# Altium schematic sheet Power_Architecture.SchDoc: PCB_Personal_Gif
size A4; DrawnBy: Ravi dusi; SheetNumber: 4; SheetTotal: 4
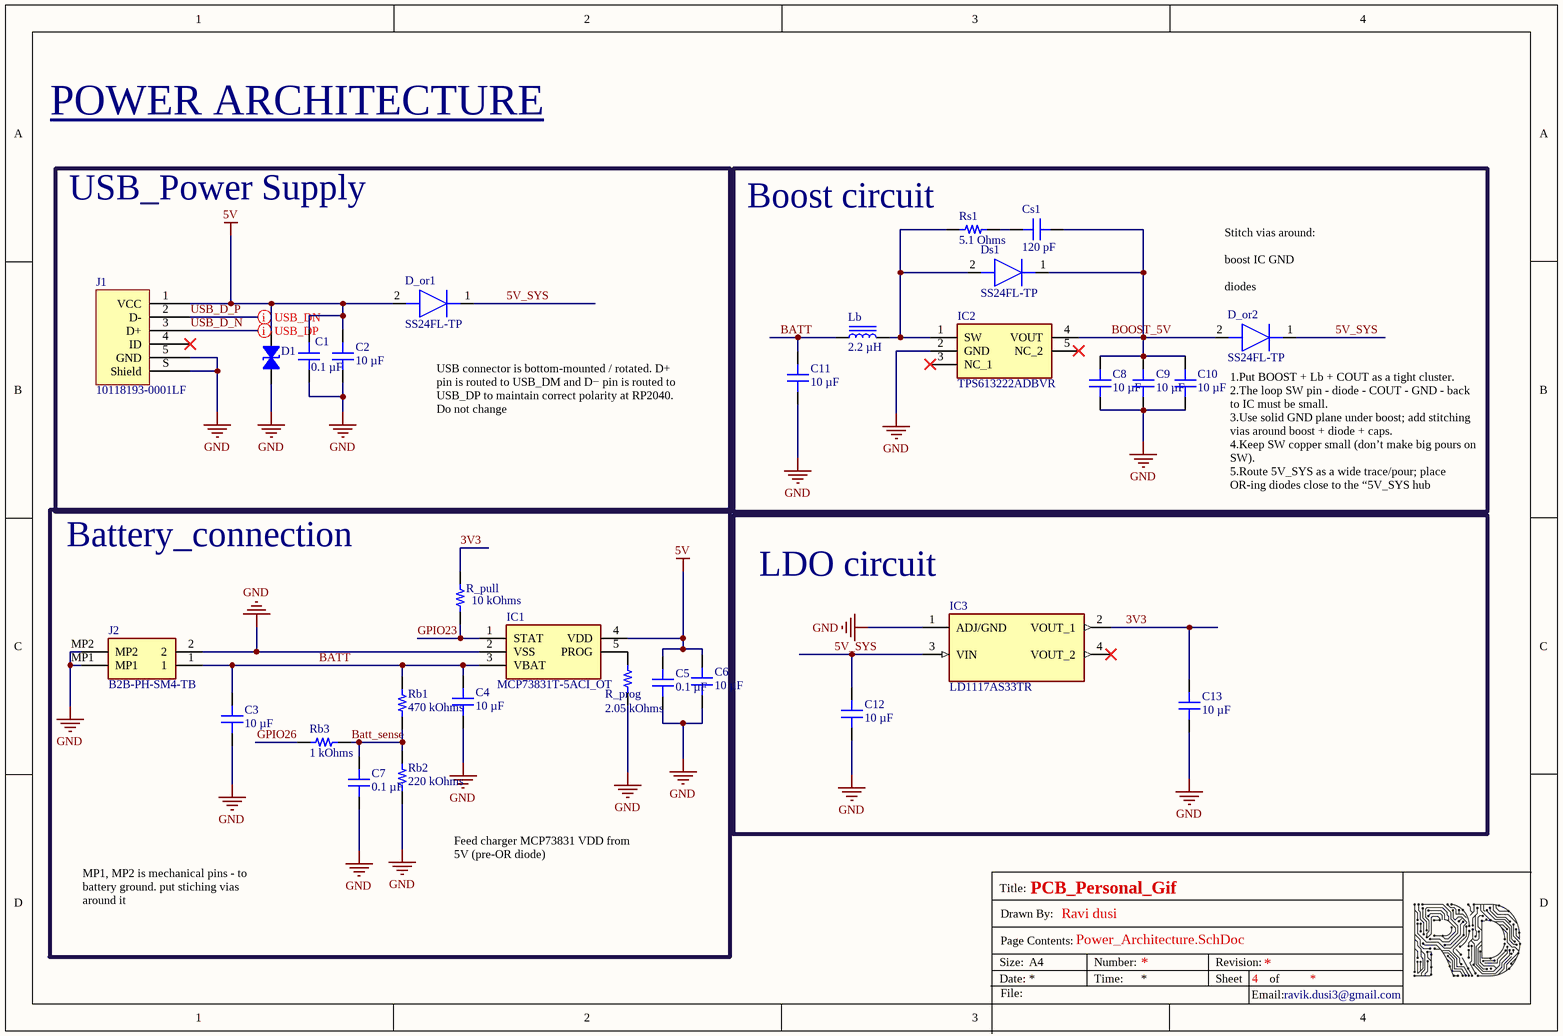
[diagram p0: Power_Architecture.SchDoc]

## Parts
C1  0.1 µF  [CAP 0402_1005]
C2  10 µF  [CAP 0402_1005]
C3  10 µF  [CAP 0402_1005]
C4  10 µF  [CAP 0402_1005]
C5  0.1 µF  [CAP 0402_1005]
C6  10 µF  [CAP 0402_1005]
C7  0.1 µF  [CAP 0402_1005]
C8  10 µF  [CAP 0402_1005]
C9  10 µF  [CAP 0402_1005]
C10  10 µF  [CAP 0402_1005]
C11  10 µF  [CAP 0402_1005]
C12  10 µF  [CAP 0402_1005]
C13  10 µF  [CAP 0402_1005]
Cs1  120 pF  [CAP 0402_1005]
D1  PGSMAJ12CA E3G  [DO214AC SMA]  (value not drawn)
D_or1  SS24FL-TP  [SODFL5026X125N]
D_or2  SS24FL-TP  [SODFL5026X125N]
Ds1  SS24FL-TP  [SODFL5026X125N]
IC1  MCP73831T-5ACI_OT  [SOT95P270X145-5N]
IC2  TPS613222ADBVR  [SOT95P280X145-5N]
IC3  LD1117AS33TR  [SOT230P700X190-4N]
J1  10118193-0001LF  [FCI USB 10118193-0001LF]
J2  B2B-PH-SM4-TB  [B2BPHSM4TB]
Lb  2.2 µH  [BOURNS SRP5030T]
R_prog  2.05 kOhms  [RES 0402_1005]
R_pull  10 kOhms  [RES 0402_1005]
Rb1  470 kOhms  [RES 0402_1005]
Rb2  220 kOhms  [YAGEO RES 0402_1005]
Rb3  1 kOhms  [YAGEO RES 0402_1005]
Rs1  5.1 Ohms  [YAGEO RES 0402_1005]

## Blocks framed on the sheet
USB_Power Supply: C1 C2 D1 D_or1 J1
Boost circuit: C8-C11 Cs1 D_or2 Ds1 IC2 Lb Rs1
Battery_connection: C3-C7 IC1 J2 R_prog R_pull Rb1-Rb3
LDO circuit: C12 C13 IC3

## Nets
5V: C1.2 C2.2 C5.2 C6.2 D1.2 D_or1.2(A) IC1.4(VDD) J1.1(VCC)
GND: C1.1 C2.1 C3.1 C4.1 C5.1 C6.1 C7.1 C8.2 C9.2 C10.2 C11.1 C12.1 C13.1 D1.1 IC1.2(VSS) IC2.2(GND) IC3.1(ADJ/GND) J1.5(GND) J1.S(Shield) J2.2 J2.MP1 J2.MP2 R_prog.1 Rb2.1
3V3: C13.2 IC3.2(VOUT_1) R_pull.2
5V_SYS: C12.2 D_or1.1(K) D_or2.1(K) IC3.3(VIN)
BATT: C3.2 C4.2 C11.2 IC1.3(VBAT) J2.1 Lb.1 Rb1.2
Batt_sense: C7.2 Rb1.1 Rb2.2 Rb3.2
BOOST_5V: C8.1 C9.1 C10.1 Cs1.2 D_or2.2(A) Ds1.1(K) IC2.4(VOUT)
GPIO23: IC1.1(STAT) R_pull.1
GPIO26: Rb3.1
USB_D_N: J1.3(D+)
USB_D_P: J1.2(D-)
NetCs1_1: Cs1.1 Rs1.2
NetDs1_2: Ds1.2(A) IC2.1(SW) Lb.2 Rs1.1
NetIC1_5: IC1.5(PROG) R_prog.2

Not connected (* = marked no-connect by the designer): IC2 3(NC_1)* 5(NC_2)*; IC3 4(VOUT_2)*; J1 4(ID)*

## Layout directives
differential pair: USB_D_N, USB_D_P

## Notes on the sheet
- POWER ARCHITECTURE
- (near D_or2) Stitch vias around:
  boost IC GND
  diodes
  LDO GND
  battery connector
- USB connector is bottom-mounted / rotated. D+ pin is routed to USB_DM and D− pin is routed to USB_DP to maintain correct polarity at RP2040. Do not change
- 1.Put BOOST + Lb + COUT as a tight cluster.
  2.The loop SW pin - diode - COUT - GND - back to IC must be small.
  3.Use solid GND plane under boost; add stitching vias around boost + diode + caps.
  4.Keep SW copper small (don’t make big pours on SW).
  5.Route 5V_SYS as a wide trace/pour; place OR-ing diodes close to the “5V_SYS hub
- MP1, MP2 is mechanical pins - to battery ground. put stiching vias around it
- Feed charger MCP73831 VDD from 5V (pre-OR diode)
- Title:
- Drawn By:
- Size:
- Date:
- File:
- Page Contents:
- A4
- Number:
- Time:
- Revision:
- Sheet
- Email:
- of
- ravik.dusi3@gmail.com

## Library data of the parts
C1 C5 C7 = C0402C104K4RECAUTO: CAP CER 0402 0.1UF 16V X7R 10%; manufacturer: KEMET; Part Number: C0402C104K4RECAUTO; Applications: Automotive, ESD Protection; Capacitance: 0.1 µF; componentlink1description: Datasheet; componentlink1url: https://api.kemet.com/component-edge/download/datasheet/C0402C104K4RECAUTO.pdf; componentlink2description: DigiKey Link; componentlink2url: https://www.digikey.com/en/products/detail/kemet/C0402C104K4RECAUTO/8563695; Device Package: 0402 (1005 Metric); Lifecycle Status: Active; Minimum Order: 1; Mounting Type: Surface Mount, MLCC; Operating Temperature: -55°C ~ 125°C; Package / Case: 0402 (1005 Metric); packaging: TapeAndReel; partid: 1731; Part Status: Active; price: 0.01; Ratings: AEC-Q200; series: ESD SMD Auto X7R; Size / Dimension: 0.039" L x 0.020" W (1.00mm x 0.50mm); Supplier 1: DigiKey; Supplier Part Number 1: 399-17167-1-ND; Temperature Coefficient: X7R; Thickness (Max): 0.022" (0.55mm); Tolerance: ±10%; Voltage - Rated: 16V
  C1: Value: 0.1 µF; lastupdated: 09/02/2024 20:04:38
  C5 C7: lastupdated: 09-02-2024 20:04:38; value: 0.1 µF
C2-C4 C6 C8-C13 = CL05A106MP8NUB8: CAP CER 10UF 10V X5R 0402; manufacturer: Samsung Electro-Mechanics; Tolerance: ±20%; Part Number: CL05A106MP8NUB8; Applications: Acoustic Noise Reduction; Capacitance: 10 µF; componentlink1description: Datasheet; componentlink1url: http://www.samsungsem.com/kr/support/product-search/mlcc/CL05A106MP8NUB8.jsp; componentlink2description: DigiKey Link; componentlink2url: https://www.digikey.com/en/products/detail/samsung-electro-mechanics/CL05A106MP8NUB8/5961314; Device Package: 0402 (1005 Metric); Lifecycle Status: Active; Minimum Order: 1; Mounting Type: Surface Mount, MLCC; Operating Temperature: -55°C ~ 85°C; Package / Case: 0402 (1005 Metric); packaging: TapeAndReel; partid: 1758; Part Status: Active; price: 0.06; series: CL; Size / Dimension: 0.039" L x 0.020" W (1.00mm x 0.50mm); Supplier 1: DigiKey; Supplier Part Number 1: 1276-6830-1-ND; Temperature Coefficient: X5R; Thickness (Max): 0.035" (0.90mm); Voltage - Rated: 10V
  C2: Value: 10 µF; lastupdated: 09/02/2024 20:04:38
  C3 C4 C6 C8-C13: lastupdated: 09-02-2024 20:04:38; value: 10 µF
Cs1 = CGA2B2C0G1H121J050BA: CAP CER 120PF 50V C0G 0402; manufacturer: TDK Corporation; Temperature Coefficient: C0G, NP0; Tolerance: ±5%; Part Number: CGA2B2C0G1H121J050BA; Capacitance: 120 pF; Applications: Automotive; componentlink1description: Datasheet; componentlink1url: https://product.tdk.com/info/en/catalog/datasheets/mlcc_automotive_general_en.pdf?ref_disty=digikey; componentlink2description: DigiKey Link; componentlink2url: https://www.digikey.com/en/products/detail/tdk-corporation/CGA2B2C0G1H121J050BA/2443075; Device Package: 0402 (1005 Metric); lastupdated: 09-02-2024 20:04:37; Lifecycle Status: Active; Minimum Order: 1; Mounting Type: Surface Mount, MLCC; Operating Temperature: -55°C ~ 125°C; Package / Case: 0402 (1005 Metric); packaging: TapeAndReel; partid: 1956; Part Status: Active; price: 0.01; Ratings: AEC-Q200; series: CGA; Size / Dimension: 0.039" L x 0.020" W (1.00mm x 0.50mm); Supplier 1: DigiKey; Supplier Part Number 1: 445-5597-1-ND; Thickness (Max): 0.022" (0.55mm); value: 120 pF; Voltage - Rated: 50V
D1 = PGSMAJ12CA E3G: DIODE, TVS, BIDIRECTIONAL; Manufacturer: Taiwan Semiconductor Corporation; Bidirectional Channels: 1; Current - Peak Pulse (10/1000µs): 20.1A; Power Line Protection: No; Power - Peak Pulse: 400W; Type: Zener; Voltage - Breakdown (Min): 13.3V; Voltage - Clamping (Max) @ Ipp: 19.9V; Voltage - Reverse Standoff (Typ): 12V; Part Number: PGSMAJ12CA E3G; Applications: Automotive; ComponentLink1Description: Datasheet; ComponentLink1URL: https://www.taiwansemi.com/products/datasheet/PGSMAJ%20SERIES_B1805.pdf; ComponentLink2Description: DigiKey Link; ComponentLink2URL: http://digikey.com/product-detail/en/taiwan-semiconductor-corporation/PGSMAJ12CA-E3G/PGSMAJ12CAE3GCT-ND/8600519; LastUpdated: 03/06/2024 20:21:21; Lifecycle Status: Active; Minimum Order: 1; Mounting Type: Surface Mount; Operating Temperature: -55°C ~ 175°C (TJ); Package / Case: DO-214AC, SMA; Packaging: TapeAndReel; PartId: 7668; Part Status: Active; Price: 0.13; Series: Automotive, AEC-Q101; Supplier 1: DigiKey; Supplier Part Number 1: PGSMAJ12CAE3GCT-ND; Supplier Device Package: DO-214AC (SMA)
D_or1 D_or2 Ds1 = SS24FL-TP: Diode; Manufacturer_Name: MCC; Datasheet Link: https://www.mccsemi.com/pdf/Products/SS22FL-SS210FL(DO-221AC).pdf; Height: 1.25mm; Manufacturer_Part_Number: SS24FL-TP; Mouser Part Number: 833-SS24FL-TP; Mouser Price/Stock: https://www.mouser.co.uk/ProductDetail/Micro-Commercial-Components-MCC/SS24FL-TP?qs=P1JMDcb91o5c0D9%2FtR3zeg%3D%3D; Arrow Part Number: SS24FL-TP; Arrow Price/Stock: https://www.arrow.com/en/products/ss24fl-tp/micro-commercial-components?utm_currency=USD&region=nac
IC1 = MCP73831T-5ACI_OT: Integrated Circuit; Manufacturer_Name: Microchip; Manufacturer_Part_Number: MCP73831T-5ACI/OT; Datasheet Link: http://www.microchip.com/mymicrochip/filehandler.aspx?ddocname=en025112; Height: 1.45mm; Mouser Part Number: 579-MCP73831T5ACIOT; Mouser Price/Stock: https://www.mouser.co.uk/ProductDetail/Microchip-Technology/MCP73831T-5ACI-OT?qs=hH%252BOa0VZEiAcgAcEkuamXg%3D%3D; Arrow Part Number: MCP73831T-5ACI/OT; Arrow Price/Stock: https://www.arrow.com/en/products/mcp73831t-5aciot/microchip-technology?utm_currency=USD&region=nac
IC2 = TPS613222ADBVR: Integrated Circuit; Manufacturer_Name: Texas Instruments; Datasheet Link: http://www.ti.com/lit/gpn/tps61322; Height: 1.45mm; Manufacturer_Part_Number: TPS613222ADBVR; Mouser Part Number: 595-TPS613222ADBVR; Mouser Price/Stock: https://www.mouser.co.uk/ProductDetail/Texas-Instruments/TPS613222ADBVR?qs=W0yvOO0ixfE4d69WXsn8NQ%3D%3D; Arrow Part Number: TPS613222ADBVR; Arrow Price/Stock: https://www.arrow.com/en/products/tps613222adbvr/texas-instruments?utm_currency=USD&region=nac
IC3 = LD1117AS33TR: Power Supply; Manufacturer_Name: STMicroelectronics; Datasheet Link: https://www.st.com/resource/en/datasheet/ld1117a.pdf; Height: 1.9mm; Manufacturer_Part_Number: LD1117AS33TR; Mouser Part Number: 511-LD1117AS33; Mouser Price/Stock: https://www.mouser.co.uk/ProductDetail/STMicroelectronics/LD1117AS33TR?qs=C3bf%2FVrkE5CoDDd7wyn%252BaQ%3D%3D; Arrow Part Number: LD1117AS33TR; Arrow Price/Stock: https://www.arrow.com/en/products/ld1117as33tr/stmicroelectronics?utm_currency=USD&region=europe
J1 = 10118193-0001LF: CONN RCPT USB2.0 MICRO B SMD R/A; Manufacturer: Amphenol ICC (FCI); Connector Type: USB - micro B; Current Rating (Amps): 1.8A per Contact; Gender: Receptacle; Mating Cycles: 10000; Number of Contacts: 5; Number of Ports: 1; Shielding: Shielded; Voltage - Rated: 100VAC; Part Number: 10118193-0001LF; ComponentLink1Description: Datasheet; ComponentLink1URL: https://cdn.amphenol-icc.com/media/wysiwyg/files/documentation/datasheet/inputoutput/io_usb_micro.pdf; ComponentLink2Description: DigiKey Link; ComponentLink2URL: //digikey.com/product-detail/en/amphenol-icc-fci/10118193-0001LF/609-4616-2-ND/2785388; Features: Solder Retention; LastUpdated: 09/12/2019 20:51:28; Lifecycle Status: 0; Minimum Order: 1; Mounting Feature: Horizontal; Mounting Type: Surface Mount, Right Angle; Through Hole; Operating Temperature: -30°C ~ 80°C; Packaging: TapeAndReel; Part Status: Active; Price: 0.21; Series: -; Specifications: USB 2.0; Supplier 1: DigiKey; Supplier Part Number 1: 609-4616-2-ND; Termination: Solder
J2 = B2B-PH-SM4-TB: Connector; Manufacturer_Name: JST (JAPAN SOLDERLESS TERMINALS); Datasheet Link: https://4donline.ihs.com/images/VipMasterIC/IC/JSTM/JSTMS02875/JSTMS02875-1.pdf?hkey=EF798316E3902B6ED9A73243A3159BB0; Height: 6.6mm; Manufacturer_Part_Number: B2B-PH-SM4-TB; Mouser Part Number: N/A; Mouser Price/Stock: https://www.mouser.co.uk/ProductDetail/JST/B2B-PH-SM4-TB?qs=vmHwEFxEFR90PqOkMJJj7w%3D%3D
Lb = SRP5030T-2R2M: FIXED IND 2.2UH 5.5A 35 MOHM SMD; Manufacturer: Bourns Inc.; Current - Saturation: 9A; DC Resistance (DCR): 35mOhm Max; Inductance Frequency - Test: 100 kHz; Material - Core: Iron Powder; Shielding: Shielded; Tolerance: ±20%; Part Number: SRP5030T-2R2M; ComponentLink1Description: Datasheet; ComponentLink1URL: https://www.bourns.com/docs/Product-Datasheets/SRP5030T.pdf; ComponentLink2Description: DigiKey Link; ComponentLink2URL: https://www.digikey.com/en/products/detail/bourns-inc/SRP5030T-2R2M/3986082; Current Rating (Amps): 5.5 A; Device Package: Nonstandard; Height - Seated (Max): 0.118" (3.00mm); Inductance: 2.2 µH; LastUpdated: 03-06-2024 20:02:35; Lifecycle Status: Active; Minimum Order: 1; Mounting Type: Surface Mount; Operating Temperature: -40°C ~ 125°C; Package / Case: Nonstandard; Packaging: TapeAndReel; PartId: 7; Part Status: Active; Price: 0.59; Series: SRP5030T; Size / Dimension: 0.224" L x 0.205" W (5.70mm x 5.20mm); Supplier 1: DigiKey; Supplier Part Number 1: SRP5030T-2R2MCT-ND; Type: Drum Core, Wirewound; Value: 2.2 µH
R_prog = CPF0402B2K05E1: RES SMD 2.05KOHM 0.1% 1/16W 0402; Manufacturer: TE Connectivity Passive Product; Power (Watts): 0.063W, 1/16W; Temperature Coefficient: ±25ppm/°C; Part Number: CPF0402B2K05E1; Value: 2.05 kOhms; ComponentLink1Description: Datasheet; ComponentLink1URL: https://www.te.com/commerce/DocumentDelivery/DDEController?Action=srchrtrv&DocNm=1773200&DocType=DS&DocLang=English; ComponentLink2Description: DigiKey Link; ComponentLink2URL: https://www.digikey.com/en/products/detail/te-connectivity-passive-product/CPF0402B2K05E1/2382422; Composition: Thin Film; Device Package: 0402 (1005 Metric); Height - Seated (Max): 0.014" (0.35mm); LastUpdated: 09-02-2024 20:30:20; Lifecycle Status: Active; Minimum Order: 1; Number of Terminations: 2; Operating Temperature: -55°C ~ 155°C; Package / Case: 0402 (1005 Metric); Packaging: TapeAndReel; PartId: 3308; Part Status: Active; Price: 0.13; Resistance: 2.05 kOhms; Series: CPF, Neohm; Size / Dimension: 0.039" L x 0.020" W (1.00mm x 0.50mm); Supplier 1: DigiKey; Supplier Part Number 1: A102763CT-ND; Supplier Device Package: 0402; Tolerance: ±0.1%
R_pull = RP73PF1E10KBTD: RES 10K OHM 0.1% 1/10W 0402; Manufacturer: TE Connectivity Passive Product; Power (Watts): 0.1W, 1/10W; Temperature Coefficient: ±25ppm/°C; Part Number: RP73PF1E10KBTD; Value: 10 kOhms; ComponentLink1Description: Datasheet; ComponentLink1URL: https://www.te.com/commerce/DocumentDelivery/DDEController?Action=srchrtrv&DocNm=1773272&DocType=DS&DocLang=English; ComponentLink2Description: DigiKey Link; ComponentLink2URL: https://www.digikey.com/en/products/detail/te-connectivity-passive-product/RP73PF1E10KBTD/8260957; Composition: Thin Film; Device Package: 0402 (1005 Metric); Height - Seated (Max): 0.014" (0.35mm); LastUpdated: 09-02-2024 20:30:24; Lifecycle Status: Active; Minimum Order: 1; Number of Terminations: 2; Operating Temperature: -55°C ~ 155°C; Package / Case: 0402 (1005 Metric); Packaging: TapeAndReel; PartId: 2434; Part Status: Active; Price: 0.08; Resistance: 10 kOhms; Series: RP73, Holsworthy; Size / Dimension: 0.039" L x 0.020" W (1.00mm x 0.50mm); Supplier 1: DigiKey; Supplier Part Number 1: A127415CT-ND; Supplier Device Package: 0402; Tolerance: ±0.1%
Rb1 = CRGP0402F470K: RES 470K OHM 1% 1/8W 0402; Manufacturer: TE Connectivity Passive Product; Power (Watts): 0.125W, 1/8W; Temperature Coefficient: ±100ppm/°C; Part Number: CRGP0402F470K; Value: 470 kOhms; ComponentLink1Description: Datasheet; ComponentLink1URL: https://www.te.com/commerce/DocumentDelivery/DDEController?Action=srchrtrv&DocNm=9-1773463-9&DocType=DS&DocLang=English; ComponentLink2Description: DigiKey Link; ComponentLink2URL: https://www.digikey.com/en/products/detail/te-connectivity-passive-product/CRGP0402F470K/8576989; Composition: Thick Film; Device Package: 0402 (1005 Metric); Features: Pulse Withstanding; Height - Seated (Max): 0.016" (0.40mm); LastUpdated: 09-02-2024 20:30:22; Lifecycle Status: Active; Minimum Order: 1; Number of Terminations: 2; Operating Temperature: -55°C ~ 155°C; Package / Case: 0402 (1005 Metric); Packaging: TapeAndReel; PartId: 2840; Part Status: Active; Price: 0.01; Resistance: 470 kOhms; Series: CRGP; Size / Dimension: 0.043" L x 0.020" W (1.10mm x 0.50mm); Supplier 1: DigiKey; Supplier Part Number 1: A130387CT-ND; Supplier Device Package: 0402; Tolerance: ±1%
Rb2 = RC0402FR-07220KL: RES 220K OHM 1% 1/16W 0402; Manufacturer: Yageo; Power (Watts): 0.063W, 1/16W; Temperature Coefficient: ±100ppm/°C; Part Number: RC0402FR-07220KL; Value: 220 kOhms; ComponentLink1Description: Datasheet; ComponentLink1URL: https://www.yageo.com/upload/media/product/productsearch/datasheet/rchip/PYu-RC_Group_51_RoHS_L_10.pdf; ComponentLink2Description: DigiKey Link; ComponentLink2URL: https://www.digikey.com/en/products/detail/yageo/RC0402FR-07220KL/726564; Composition: Thick Film; Device Package: 0402 (1005 Metric); Features: Moisture Resistant; Height - Seated (Max): 0.016" (0.40mm); LastUpdated: 31-08-2025 15:04:18; Lifecycle Status: Active; Minimum Order: 1; Number of Terminations: 2; Operating Temperature: -55°C ~ 155°C; Package / Case: 0402 (1005 Metric); Packaging: CutTape; PartId: 2589; Part Status: Active; Price: 0.01; Resistance: 220 kOhms; Series: RC_L; Size / Dimension: 0.039" L x 0.020" W (1.00mm x 0.50mm); Supplier 1: DigiKey; Supplier Part Number 1: 311-220KLRCT-ND; Supplier Device Package: 0402; Tolerance: ±1%
Rb3 = AT0402BRD071KL: RES SMD 1K OHM 0.1% 1/16W 0402; Manufacturer: Yageo; Power (Watts): 0.063W, 1/16W; Temperature Coefficient: ±25ppm/°C; Part Number: AT0402BRD071KL; Value: 1 kOhms; ComponentLink1Description: Datasheet; ComponentLink1URL: http://www.yageo.com/documents/recent/PYu-AT_51_RoHS_L_5.pdf; ComponentLink2Description: DigiKey Link; ComponentLink2URL: https://www.digikey.com/en/products/detail/yageo/AT0402BRD071KL/5138607; Composition: Thin Film; Device Package: 0402 (1005 Metric); Features: Anti-Sulfur, Automotive AEC-Q200, Moisture Resistant; Height - Seated (Max): 0.014" (0.35mm); LastUpdated: 31-08-2025 15:04:18; Lifecycle Status: Active; Minimum Order: 1; Number of Terminations: 2; Operating Temperature: -55°C ~ 155°C; Package / Case: 0402 (1005 Metric); Packaging: TapeAndReel; PartId: 2462; Part Status: Active; Price: 0.09; Ratings: AEC-Q200; Resistance: 1 kOhms; Series: AT; Size / Dimension: 0.039" L x 0.020" W (1.00mm x 0.50mm); Supplier 1: DigiKey; Supplier Part Number 1: YAG2088CT-ND; Supplier Device Package: 0402; Tolerance: ±0.1%
Rs1 = RC0402JR-075R1L: RES 5.1 OHM 5% 1/16W 0402; Manufacturer: Yageo; Power (Watts): 0.063W, 1/16W; Temperature Coefficient: ±200ppm/°C; Part Number: RC0402JR-075R1L; Value: 5.1 Ohms; ComponentLink1Description: Datasheet; ComponentLink1URL: https://www.yageo.com/upload/media/product/productsearch/datasheet/rchip/PYu-RC_Group_51_RoHS_L_10.pdf; ComponentLink2Description: DigiKey Link; ComponentLink2URL: https://www.digikey.com/en/products/detail/yageo/RC0402JR-075R1L/726486; Composition: Thick Film; Device Package: 0402 (1005 Metric); Features: Moisture Resistant; Height - Seated (Max): 0.016" (0.40mm); LastUpdated: 31-08-2025 15:04:17; Lifecycle Status: Active; Minimum Order: 1; Number of Terminations: 2; Operating Temperature: -55°C ~ 155°C; Package / Case: 0402 (1005 Metric); Packaging: CutTape; PartId: 3416; Part Status: Active; Price: 0.01; Resistance: 5.1 Ohms; Series: RC_L; Size / Dimension: 0.039" L x 0.020" W (1.00mm x 0.50mm); Supplier 1: DigiKey; Supplier Part Number 1: 311-5.1JRCT-ND; Supplier Device Package: 0402; Tolerance: ±5%